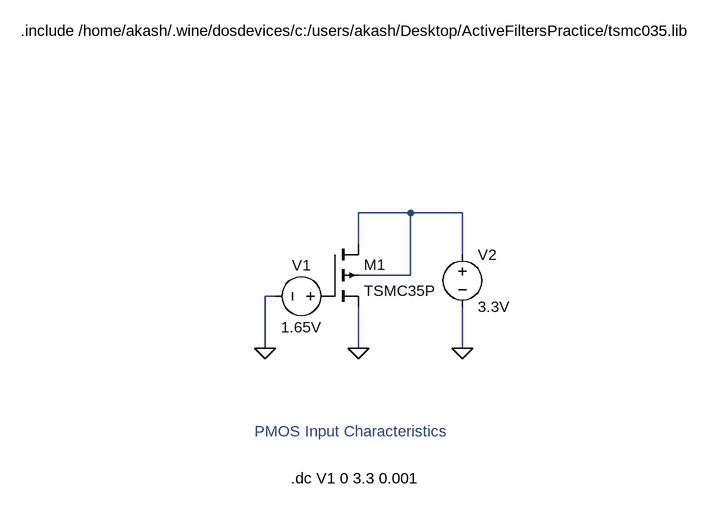
[diagram p0: schematic PMOS_Input_Characteristics.asc]
PMOS_Input_Characteristics.asc, the LTspice schematic file:
Version 4
SHEET 1 1076 680
WIRE 512 112 432 112
WIRE 592 112 512 112
WIRE 432 160 432 112
WIRE 592 176 592 112
WIRE 512 208 512 112
WIRE 512 208 432 208
WIRE 304 240 288 240
WIRE 288 320 288 240
WIRE 432 320 432 256
WIRE 592 320 592 256
FLAG 432 320 0
FLAG 288 320 0
FLAG 592 320 0
SYMBOL pmos4 384 160 R0
SYMATTR InstName M1
SYMATTR Value TSMC35P
SYMATTR Value2 l=0.5u w=5u
SYMBOL voltage 400 240 R90
WINDOW 0 -32 56 VBottom 2
WINDOW 3 32 56 VTop 2
WINDOW 123 0 0 Left 0
WINDOW 39 0 0 Left 0
SYMATTR InstName V1
SYMATTR Value 1.65V
SYMBOL voltage 592 160 R0
WINDOW 123 0 0 Left 0
WINDOW 39 0 0 Left 0
SYMATTR InstName V2
SYMATTR Value 3.3V
TEXT -88 -168 Left 2 !.include /home/akash/.wine/dosdevices/c:/users/akash/Desktop/ActiveFiltersPractice/tsmc035.lib
TEXT 328 520 Left 2 !.dc V1 0 3.3 0.001
TEXT 272 448 Left 2 ;PMOS Input Characteristics

The netlist it stands for:
* PMOS_Input_Characteristics.asc
M1 N001 P001 0 N001 TSMC35P l=0.5u w=5u
V1 P001 0 1.65V
V2 N001 0 3.3V
.model NMOS NMOS
.model PMOS PMOS
.lib standard.mos
.include /home/akash/.wine/dosdevices/c:/users/akash/Desktop/ActiveFiltersPractice/tsmc035.lib
.dc V1 0 3.3 0.001
* PMOS Input Characteristics
.backanno
.end